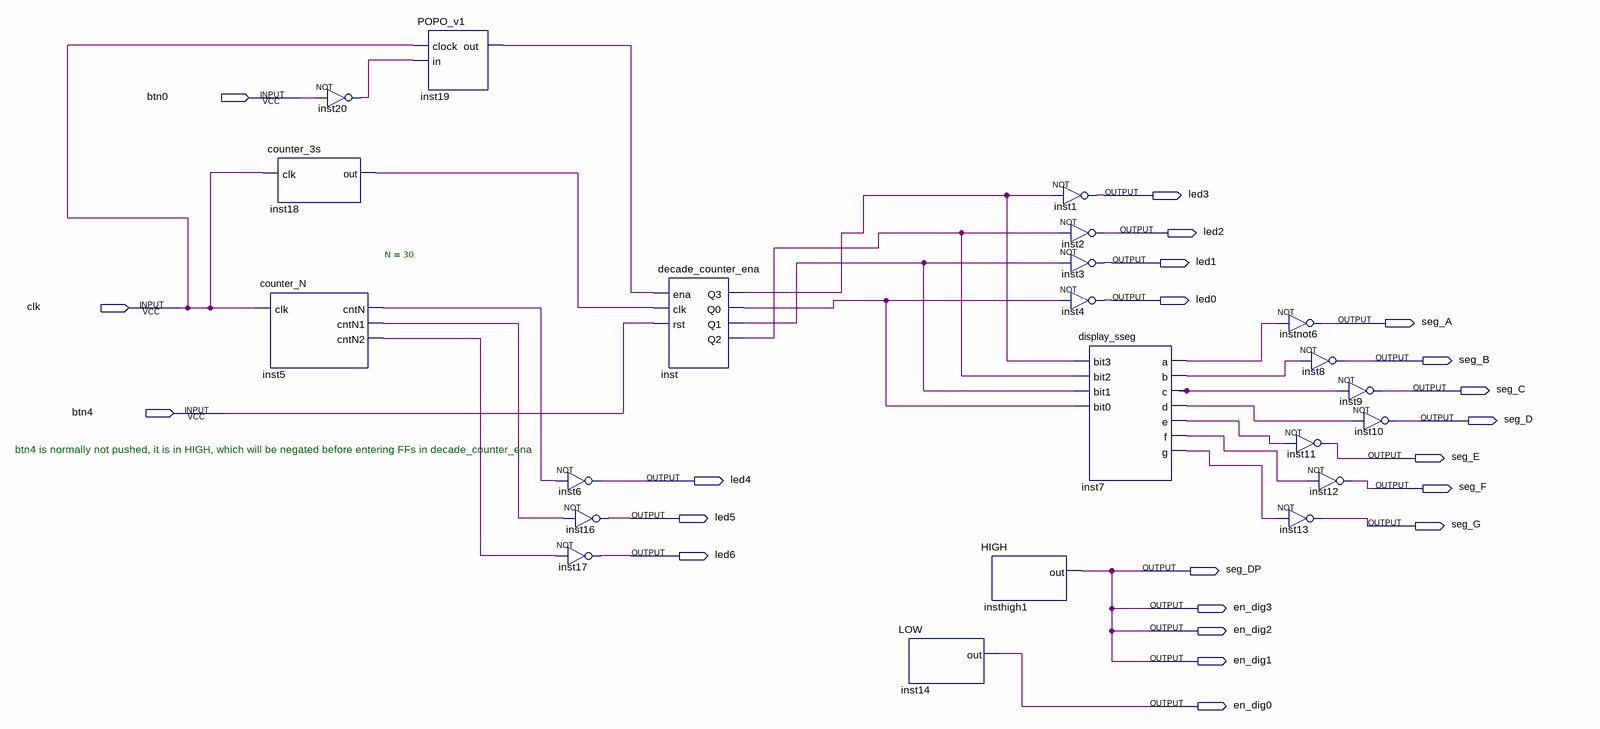
[diagram p0: schematic sheet]
// Quartus schematic test_POPO_decade_counter.bdf as structural Verilog: 22 symbols, 22 pins
module test_POPO_decade_counter (
  input  btn0,
  input  clk,
  input  btn4,
  output led3,
  output led2,
  output led1,
  output led0,
  output seg_A,
  output seg_B,
  output seg_C,
  output seg_D,
  output seg_E,
  output led4,
  output seg_F,
  output led5,
  output seg_G,
  output led6,
  output seg_DP,
  output en_dig3,
  output en_dig2,
  output en_dig1,
  output en_dig0
);

  wire inst5_cntn, inst5_cntn1, inst5_cntn2, inst7_a, inst7_b, inst7_c, inst7_d, inst7_e, inst7_f, inst7_g,
       inst18_out, inst19_out, inst20_out, inst_q0, inst_q1, inst_q2, inst_q3;

  counter_3s inst18 (.clk(clk), .out(inst18_out));
  counter_N #(.N(30)) inst5 (.clk(clk), .cntN(inst5_cntn), .cntN1(inst5_cntn1), .cntN2(inst5_cntn2));
  not inst20 (inst20_out, btn0);
  POPO_v1 inst19 (.clock(clk), .in(inst20_out), .out(inst19_out));
  not inst6 (led4, inst5_cntn);
  not inst16 (led5, inst5_cntn1);
  not inst17 (led6, inst5_cntn2);
  decade_counter_ena inst (
    .ena(inst19_out), .clk(inst18_out), .rst(btn4), .Q3(inst_q3), .Q0(inst_q0), .Q1(inst_q1), .Q2(inst_q2));
  LOW inst14 (.out(en_dig0));
  HIGH insthigh1 (.out(en_dig1));
  not inst1 (led3, inst_q3);
  not inst2 (led2, inst_q2);
  not inst3 (led1, inst_q1);
  not inst4 (led0, inst_q0);
  display_sseg inst7 (
    .bit3(inst_q3), .bit2(inst_q2), .bit1(inst_q1), .bit0(inst_q0), .a(inst7_a), .b(inst7_b), .c(inst7_c),
    .d(inst7_d), .e(inst7_e), .f(inst7_f), .g(inst7_g));
  not instnot6 (seg_A, inst7_a);
  not inst8 (seg_B, inst7_b);
  not inst11 (seg_E, inst7_e);
  not inst12 (seg_F, inst7_f);
  not inst13 (seg_G, inst7_g);
  not inst9 (seg_C, inst7_c);
  not inst10 (seg_D, inst7_d);

  assign en_dig2 = en_dig1;
  assign en_dig3 = en_dig1;
  assign seg_DP = en_dig1;

  // Notes on the sheet:
  //   btn4 is normally not pushed, it is in HIGH, which will be negated before entering FFs in decade_counter_ena
endmodule
